# EAGLE schematic conventions (EAGLE 9.2.0)
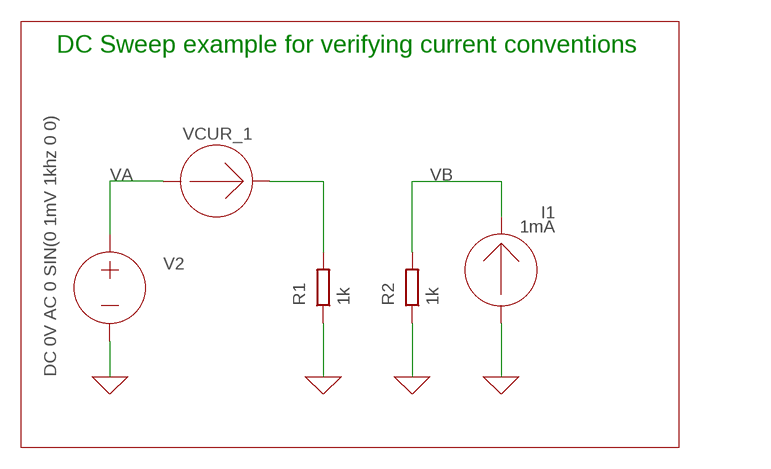
[diagram p0: schematic, sheet 1]

## Parts
I1  1mA  CURRENT  (no package)
R1  1k  R  (no package)
R2  1k  R  (no package)
V2  DC 0V AC 0 SIN(0 1mV 1khz 0 0)  VOLTAGE  (no package)
VCUR_1  0V  AMMETER  (no package)

## Nets
0: I1.+ R1.1 R2.1 V2.- ; supply symbol labelled GND
N$1: R1.2 VCUR_1.-
VA: V2.+ VCUR_1.+
VB: I1.- R2.2

## Notes on the sheet
- DC Sweep example for verifying current conventions

## Library data of the parts
I1 = ngspice-simulation:CURRENT: Independent Current Source; VALUE: 0A
R1 R2 = ngspice-simulation:R: RESISTOR
V2 = ngspice-simulation:VOLTAGE: Independent Voltage Source, either DC, AC, PULSE, SINE, PWL, EXP, or SFFM; VALUE: 0V
VCUR_1 = ngspice-simulation:AMMETER: AMMETER